# EAGLE schematic Z-ONE (EAGLE 7.2.0)
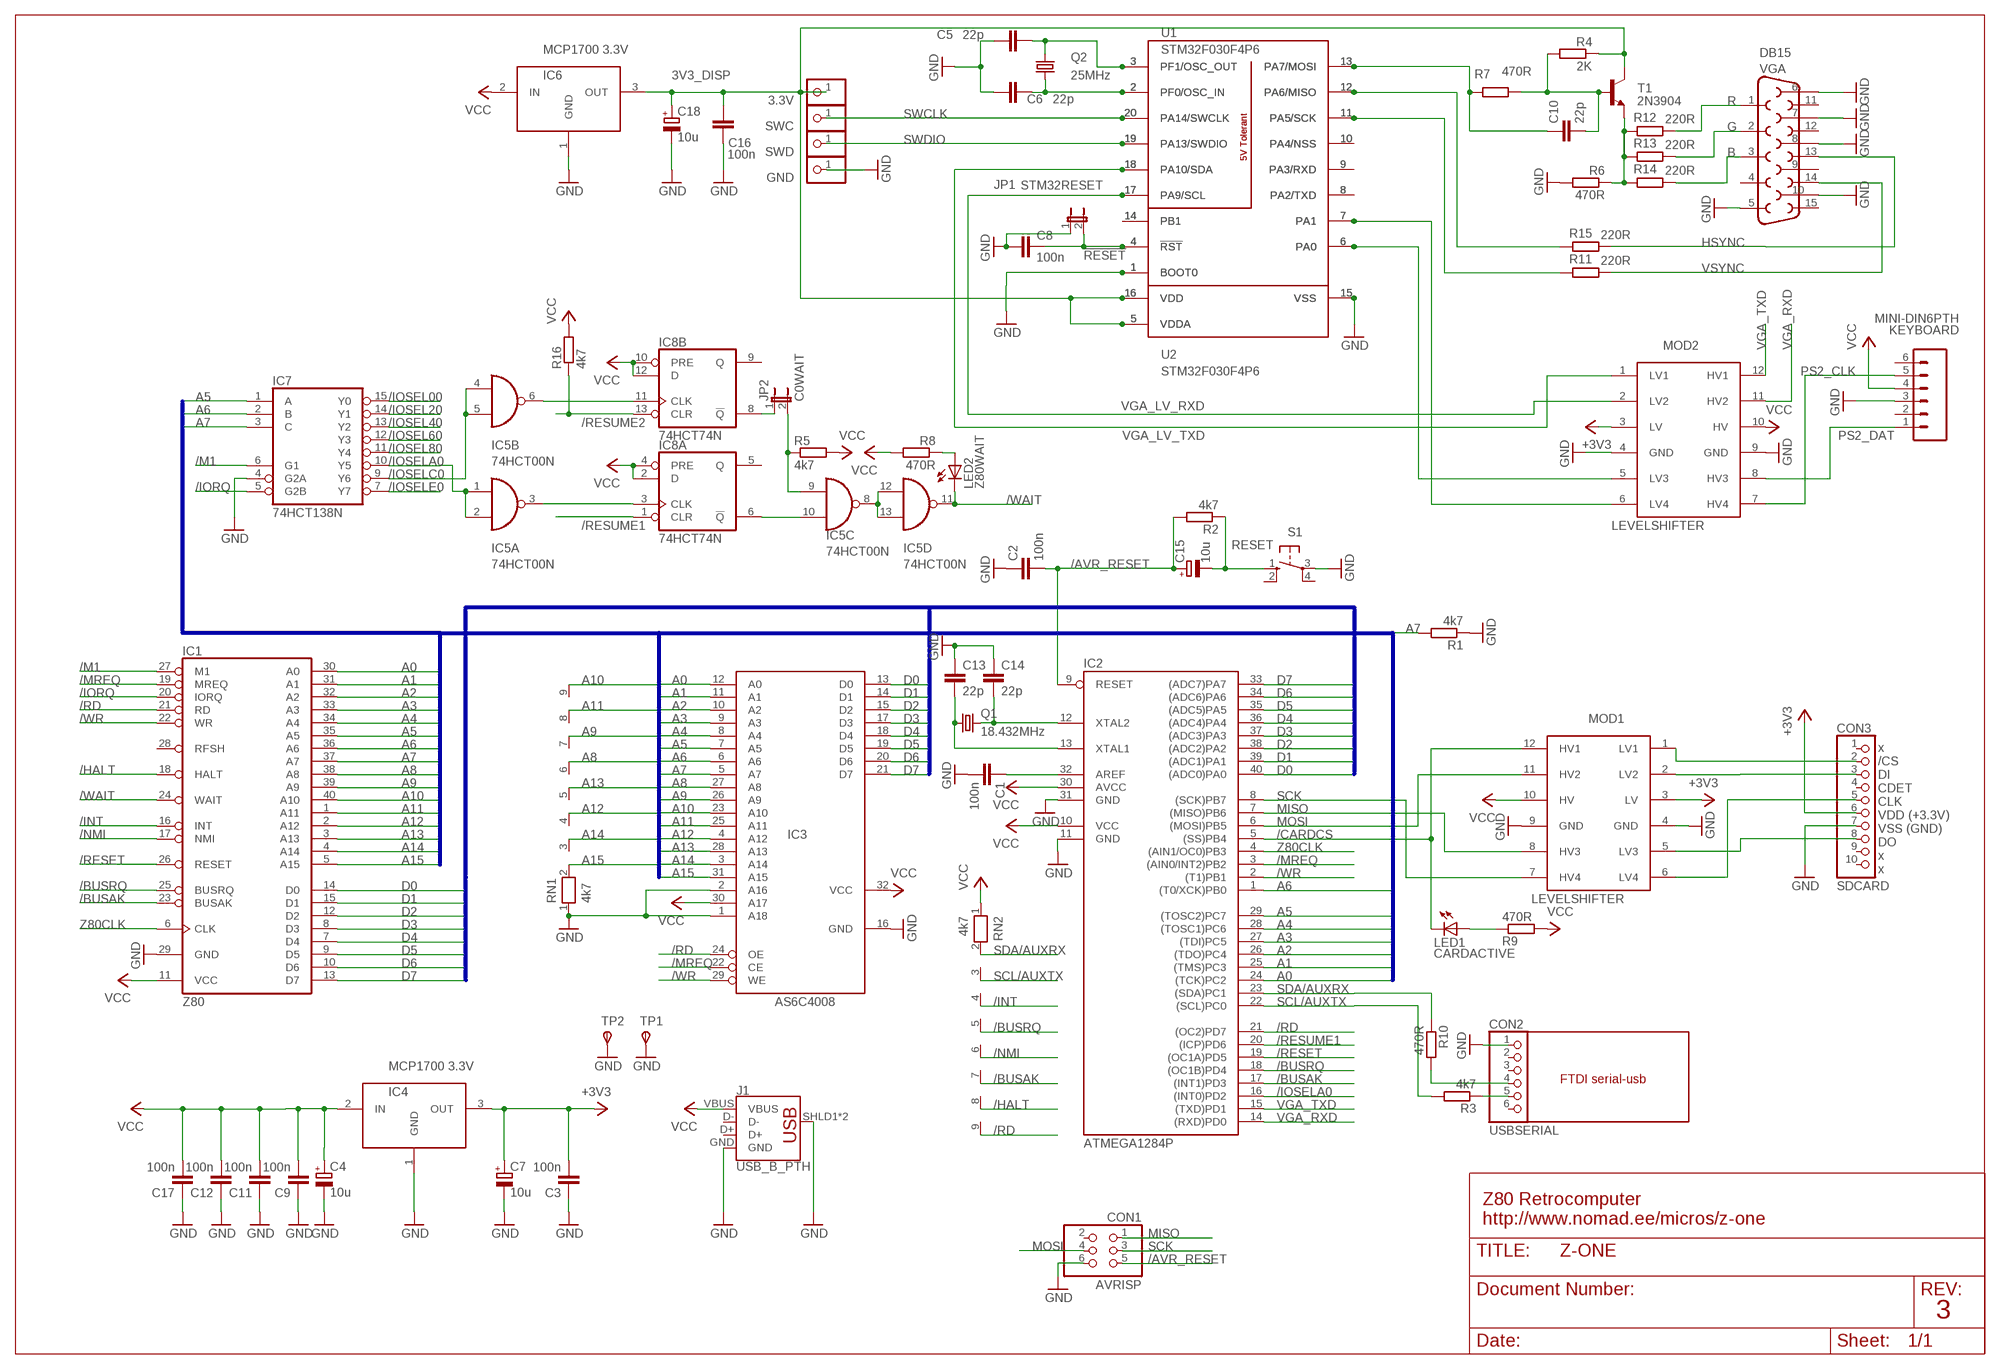
[diagram p0: schematic, sheet 1]

## Parts
3.3V  PINHD-1X1  [1X01]
C1  100n  C-EU025-025X050  [C025-025X050]
C2  100n  C-EU025-025X050  [C025-025X050]
C3  100n  C-EU025-025X050  [C025-025X050]
C4  10u  CPOL-EUE2.5-5  [E2,5-5]
C5  22p  C-EU025-025X050  [C025-025X050]
C6  22p  C-EU025-025X050  [C025-025X050]
C7  10u  CPOL-EUE2.5-5  [E2,5-5]
C8  100n  C-EU025-025X050  [C025-025X050]
C9  100n  C-EU025-025X050  [C025-025X050]
C10  22p  C-EU025-025X050  [C025-025X050]
C11  100n  C-EU025-025X050  [C025-025X050]
C12  100n  C-EU025-025X050  [C025-025X050]
C13  22p  C-EU025-025X050  [C025-025X050]
C14  22p  C-EU025-025X050  [C025-025X050]
C15  10u  CPOL-EUE2.5-5  [E2,5-5]
C16  100n  C-EU025-025X050  [C025-025X050]
C17  100n  C-EU025-025X050  [C025-025X050]
C18  10u  CPOL-EUE2.5-5  [E2,5-5]
CON1  AVRISP  PINHD-2X3  [2X03]
CON2  USBSERIAL  PINHD-1X6  [1X06]
CON3  SDCARD  PINHD-1X10  [1X10]
GND  PINHD-1X1  [1X01]
IC1  Z80  Z80CPU  [DIL40]
IC2  ATMEGA1284P  MEGA32-P  [DIL40]
IC3  AS6C4008  AS6C4008DIP32  [DIP32]
IC4  MCP1700 3.3V  MCP1700TO92  [TO-92]
IC5  74HCT00N  [DIL14]
IC6  MCP1700 3.3V  MCP1700TO92  [TO-92]
IC7  74HCT138N  [DIL16]
IC8  74HCT74N  [DIL14]
J1  USB_B_PTH  [USB-B-PTH]
JP1  STM32RESET  JUMPER-2PTH  [1X02]
JP2  C0WAIT  JUMPER-2PTH  [1X02]
KEYBOARD  MINI-DIN6PTH  [MINI-DIN6]
LED1  CARDACTIVE  LED3MM  [LED3MM]
LED2  Z80WAIT  LED3MM  [LED3MM]
MOD1  LEVELSHIFTER  LEVELSHIFTERNARROW  [LAVELSHIFTER_N]
MOD2  LEVELSHIFTER  LEVELSHIFTERNARROW  [LAVELSHIFTER_N]
Q1  18.432MHz  CRYSTALHC49S  [HC49/S]
Q2  25MHz  CRYSTALHC49S  [HC49/S]
R1  4k7  R-EU_0204/7  [0204/7]
R2  4k7  R-EU_0204/7  [0204/7]
R3  4k7  R-EU_0204/7  [0204/7]
R4  2K  R-EU_0204/7  [0204/7]
R5  4k7  R-EU_0204/7  [0204/7]
R6  470R  R-EU_0204/7  [0204/7]
R7  470R  R-EU_0204/7  [0204/7]
R8  470R  R-EU_0204/7  [0204/7]
R9  470R  R-EU_0204/7  [0204/7]
R10  470R  R-EU_0204/7  [0204/7]
R11  220R  R-EU_0204/7  [0204/7]
R12  220R  R-EU_0204/7  [0204/7]
R13  220R  R-EU_0204/7  [0204/7]
R14  220R  R-EU_0204/7  [0204/7]
R15  220R  R-EU_0204/7  [0204/7]
R16  4k7  R-EU_0204/7  [0204/7]
RN1  4k7  RN08  [RN-9]
RN2  4k7  RN08  [RN-9]
S1  RESET  10-XX  [B3F-10XX]
SWC  PINHD-1X1  [1X01]
SWD  PINHD-1X1  [1X01]
T1  2N3904  [TO92]
TP1  GND  TPSPAD1-13  [P1-13]
TP2  GND  TPSPAD1-13  [P1-13]
U1  STM32F030F4P6  MISC-PROCESSOR_STM32F030F4P6DIL20MODULE  [DIL20WIDE]
U2  STM32F030F4P6  MISC-PROCESSOR_STM32F030F4P6  [MISC-PROCESSOR_TSSOP20]
VGA  DB15  [DB15]

## Nets
3V3_DISP: 3.3V.1 C16.1 C18.+ IC6.3(OUT) R4.1 T1.1(C) U1.5(VDDA) U1.16(VDD) U2.5(VDDA) U2.16(VDD)
25MHZ: C5.2 Q2.2 U1.3(PF1/OSC_OUT) U2.3(PF1/OSC_OUT)
!RESET: C8.1 JP1.2 U1.4(!RST) U2.4(!RST)
+3.3V: C3.2 C7.+ CON3.6 IC4.3(OUT) MOD1.3(LV) MOD2.3(LV) ; supply symbol labelled +3V3
/AVR_RESET: C2.2 C15.+ CON1.5 IC2.9(RESET) R2.2
/BUSAK: IC1.23(BUSAK) IC2.17((INT1)PD3) RN2.7
/BUSRQ: IC1.25(BUSRQ) IC2.18((OC1B)PD4) RN2.5
/CARDCS: IC2.5((SS)PB4) LED1.K(C) MOD1.12(HV1)
/HALT: IC1.18(HALT) RN2.8
/INT: IC1.16(INT) RN2.4
/IORQ: IC1.20(IORQ) IC7.5(G2B)
/IOSEL00: IC7.15(Y0)
/IOSEL20: IC7.14(Y1)
/IOSEL40: IC7.13(Y2)
/IOSEL60: IC7.12(Y3)
/IOSEL80: IC7.11(Y4)
/IOSELA0: IC2.16((INT0)PD2) IC5.1(A:I0) IC5.2(A:I1) IC7.10(Y5)
/IOSELC0: IC5.4(B:I0) IC5.5(B:I1) IC7.9(Y6)
/IOSELE0: IC7.7(Y7)
/M1: IC1.27(M1) IC7.6(G1)
/MREQ: IC1.19(MREQ) IC2.3((AIN0/INT2)PB2) IC3.22(CE)
/NMI: IC1.17(NMI) RN2.6
/RD: IC1.21(RD) IC2.21((OC2)PD7) IC3.24(OE) RN2.9
/RESET: IC1.26(RESET) IC2.19((OC1A)PD5)
/RESUME1: IC2.20((ICP)PD6) IC8.1(A:CLR)
/RESUME2: IC8.13(B:CLR) R16.1
/WAIT: IC1.24(WAIT) IC5.11(D:O) LED2.K(C)
/WR: IC1.22(WR) IC2.2((T1)PB1) IC3.29(WE)
A0: IC1.30(A0) IC2.24((TCK)PC2) IC3.12(A0)
A1: IC1.31(A1) IC2.25((TMS)PC3) IC3.11(A1)
A2: IC1.32(A2) IC2.26((TDO)PC4) IC3.10(A2)
A3: IC1.33(A3) IC2.27((TDI)PC5) IC3.9(A3)
A4: IC1.34(A4) IC2.28((TOSC1)PC6) IC3.8(A4)
A5: IC1.35(A5) IC2.29((TOSC2)PC7) IC3.7(A5) IC7.1(A)
A6: IC1.36(A6) IC2.1((T0/XCK)PB0) IC3.6(A6) IC7.2(B)
A7: IC1.37(A7) IC3.5(A7) IC7.3(C) R1.2
A8: IC1.38(A8) IC3.27(A8) RN1.6
A9: IC1.39(A9) IC3.26(A9) RN1.7
A10: IC1.40(A10) IC3.23(A10) RN1.9
A11: IC1.1(A11) IC3.25(A11) RN1.8
A12: IC1.2(A12) IC3.4(A12) RN1.4
A13: IC1.3(A13) IC3.28(A13) RN1.5
A14: IC1.4(A14) IC3.3(A14) RN1.3
A15: IC1.5(A15) IC3.31(A15) RN1.2
B: R14.1 VGA.3
D0: IC1.14(D0) IC2.40((ADC0)PA0) IC3.13(D0)
D1: IC1.15(D1) IC2.39((ADC1)PA1) IC3.14(D1)
D2: IC1.12(D2) IC2.38((ADC2)PA2) IC3.15(D2)
D3: IC1.8(D3) IC2.37((ADC3)PA3) IC3.17(D3)
D4: IC1.7(D4) IC2.36((ADC4)PA4) IC3.18(D4)
D5: IC1.9(D5) IC2.35((ADC5)PA5) IC3.19(D5)
D6: IC1.10(D6) IC2.34((ADC6)PA6) IC3.20(D6)
D7: IC1.13(D7) IC2.33((ADC7)PA7) IC3.21(D7)
G: R13.1 VGA.2
GND: C1.2 C2.1 C3.1 C4.- C5.1 C6.1 C7.- C8.2 C9.1 C11.1 C12.1 C13.1 C14.1 C16.2 C17.1 C18.- CON1.6 CON2.1 CON3.7 GND.1 IC1.29(GND) IC2.11(GND) IC2.31(GND) IC3.1(A18) IC3.2(A16) IC3.16(GND) IC4.1(GND) IC6.1(GND) IC7.4(G2A) J1.GND J1.SHLD1(SHIELD) J1.SHLD2(SHIELD) JP1.1 KEYBOARD.3 MOD1.4(GND) MOD1.9(GND) MOD2.4(GND) MOD2.9(GND) R1.1 R6.2 RN1.1 S1.3(P) TP1.TP(PP) TP2.TP(PP) U1.1(BOOT0) U1.15(VSS) U2.1(BOOT0) U2.15(VSS) VGA.5 VGA.6 VGA.7 VGA.8 VGA.10
HSYNC: R15.1 VGA.13
MISO: CON1.1 IC2.7((MISO)PB6) MOD1.8(HV3)
MOSI: CON1.4 IC2.6((MOSI)PB5) MOD1.11(HV2)
N$1: C6.2 Q2.1 U1.2(PF0/OSC_IN) U2.2(PF0/OSC_IN)
N$2: R15.2 U1.12(PA6/MISO) U2.12(PA6/MISO)
N$3: IC5.3(A:O) IC8.3(A:CLK)
N$4: R6.1 R12.2 R13.2 R14.2 T1.3(E)
N$5: C14.2 IC2.12(XTAL2) Q1.2
N$6: C1.1 IC2.32(AREF)
N$8: R11.2 U1.11(PA5/SCK) U2.11(PA5/SCK)
N$9: MOD2.6(LV4) U1.7(PA1) U2.7(PA1)
N$10: MOD2.5(LV3) U1.6(PA0) U2.6(PA0)
N$11: C10.2 R4.2 R7.1 T1.2(B)
N$12: C10.1 R7.2 U1.13(PA7/MOSI) U2.13(PA7/MOSI)
N$14: U1.8(PA2/TXD) U2.8(PA2/TXD)
N$15: CON2.5 R3.1
N$16: CON3.3 MOD1.2(LV2)
N$17: IC5.9(C:I0) JP2.2 R5.1
N$18: CON3.8 MOD1.5(LV3)
N$19: CON3.5 MOD1.6(LV4)
N$20: IC5.6(B:O) IC8.11(B:CLK)
N$21: C13.2 IC2.13(XTAL1) Q1.1
N$22: U1.9(PA3/RXD) U2.9(PA3/RXD)
N$24: IC8.8(B:!Q) JP2.1
N$103: U1.10(PA4/NSS) U2.10(PA4/NSS)
N$104: CON2.4 R10.2
N$448: U1.14(PB1) U2.14(PB1)
N$532: IC5.10(C:I1) IC8.6(A:!Q)
N$533: C15.- R2.1 S1.1(S)
N$534: CON3.2 MOD1.1(LV1)
N$536: IC5.8(C:O) IC5.12(D:I0) IC5.13(D:I1)
N$692: LED2.A R8.1
N$693: LED1.A R9.1
PS2_CLK: KEYBOARD.5 MOD2.7(HV4)
PS2_DAT: KEYBOARD.1 MOD2.8(HV3)
R: R12.1 VGA.1
SCK: CON1.3 IC2.8((SCK)PB7) MOD1.7(HV4)
SCL/AUXTX: IC2.22((SCL)PC0) R3.2 RN2.3
SDA/AUXRX: IC2.23((SDA)PC1) R10.1 RN2.2
SWCLK: SWC.1 U1.20(PA14/SWCLK) U2.20(PA14/SWCLK)
SWDIO: SWD.1 U1.19(PA13/SWDIO) U2.19(PA13/SWDIO)
VCC: C4.+ C9.2 C11.2 C12.2 C17.2 IC1.11(VCC) IC2.10(VCC) IC2.30(AVCC) IC3.30(A17) IC3.32(VCC) IC4.2(IN) IC6.2(IN) IC8.2(A:D) IC8.4(A:PRE) IC8.10(B:PRE) IC8.12(B:D) J1.VBUS KEYBOARD.4 MOD1.10(HV) MOD2.10(HV) R5.2 R8.2 R9.2 R16.2 RN2.1
VGA_LV_RXD: MOD2.2(LV2) U1.17(PA9/SCL) U2.17(PA9/SCL)
VGA_LV_TXD: MOD2.1(LV1) U1.18(PA10/SDA) U2.18(PA10/SDA)
VGA_RXD: IC2.14((RXD)PD0) MOD2.11(HV2)
VGA_TXD: IC2.15((TXD)PD1) MOD2.12(HV1)
VSYNC: R11.1 VGA.14
Z80CLK: IC1.6(CLK) IC2.4((AIN1/OC0)PB3)
Unconnected: CON1.2 CON2.2 CON2.3 CON2.6 CON3.1 CON3.4 CON3.9 CON3.10 IC1.28(RFSH) IC8.5(A:Q) IC8.9(B:Q) J1.D+ J1.D- KEYBOARD.2 KEYBOARD.6 S1.2(S1) S1.4(P1) VGA.4 VGA.9 VGA.11 VGA.12 VGA.15

## Buses
A[0..15]
D[0..7]

## Notes on the sheet
- x
  /CS
  DI
  CDET
  CLK
  VDD (+3.3V)
  VSS (GND)
  DO
  x
  x
- FTDI serial-usb
- Z80 Retrocomputer
  http://www.nomad.ee/micros/z-one
- 3

## Power pins joined to a net without a drawn wire
GND: IC5.7(P:GND) IC7.8(GND) IC8.7(P:GND)
VCC: IC5.14(P:VCC) IC7.16(VCC) IC8.14(P:VCC)

## Library data of the parts
3.3V GND SWC SWD = pinhead:PINHD-1X1: PIN HEADER
C1-C3 C8 C9 C11-C14 C16 C17 = rcl:C-EU: CAPACITOR, European symbol; PARTNO: 0.1UF, 0603
C4 C7 C15 C18 = rcl:CPOL-EU: POLARIZED CAPACITOR, European symbol
C5 C6 C10 = rcl:C-EU: CAPACITOR, European symbol; PARTNO: 22PF, 0603
CON1 = pinhead:PINHD-2X3: PIN HEADER
CON2 = pinhead:PINHD-1X6: PIN HEADER
CON3 = pinhead:PINHD-1X10: PIN HEADER
IC1 = zilog:Z80CPU: Z80 FAMILY DEVICE
IC2 = atmel:MEGA32-P: MICROCONTROLLER 32 Kbytes FLASH 2 Kbytes SRAM 1 Kbytes EEPROM USART 8-channel 10 bit ADC Source: www.atmel.com .. doc2503.pdf; MPN: ATMEGA32-16PU; OC_FARNELL: 1661729; OC_NEWARK: 51P1794
IC3 = mast:AS6C4008
IC4 IC6 = mast:MCP1700
IC5 = 74xx-eu:74*00: Quad 2-input NAND gate
IC7 = 74xx-eu:74*138: 3-line to 8-line DECODER/DEMULTIPLEXER
IC8 = 74xx-eu:74*74: Dual D type positive edge triggered FLIP FLOP, preset and clear
J1 = SparkFun-Connectors:USB_B: USB Type B Connector SparkFun Products: SparkFun Stepoko <https://www.sparkfun.com/products/13899> PTH; PROD_ID: CONN-08278; SF_ID: PRT-00139
JP1 JP2 = SparkFun-Retired:JUMPER-2: Jumper Basic 0.1" spaced jumper. Use with breakaway headers.
KEYBOARD = SparkFun-Retired:MINI-DIN6: Mini DIN 6 Connector SparkFun used to sell this connector and has used it on a couple designs, however the connector and the designs are now retired. Mini DIN 6 Connector [RETIRED] <https://www.sparkfun.com/products/retired/8509> SparkFun Key Counter - PS2 [RETIRED] <https://www.sparkfun.com/products/retired/8652> Commonly found on the back of a computer for PS2 keyboard and mice. Schematic and footprint are proven.
LED1 LED2 = led:LED: LED OSRAM: - CHIPLED LG R971, LG N971, LY N971, LG Q971, LY Q971, LO R971, LY R971 LH N974, LH R974 LS Q976, LO Q976, LY Q976 LO Q996 - Hyper CHIPLED LW Q18S LB Q993, LB Q99A, LB R99A - SideLED LS A670, LO A670, LY A670, LG A670, LP A670 LB A673, LV A673, LT A673, LW A673 LH A674 LY A675 LS A676, LA A676, LO A676, LY A676, LW A676 LS A679, LY A679, LG A679 - Hyper Micro SIDELED® LS Y876, LA Y876, LO Y876, LY Y876 LT Y87S - SmartLED LW L88C, LW L88S LB L89C, LB L89S, LG L890 LS L89K, LO L89K, LY L89K LS L896, LA L896, LO L896, LY L896 - TOPLED LS T670, LO T670, LY T670, LG T670, LP T670 LSG T670, LSP T670, LSY T670, LOP T670, LYG T670 LG T671, LOG T671, LSG T671 LB T673, LV T673, LT T673, LW T673 LH T674 LS T676, LA T676, LO T676, LY T676, LB T676, LH T676, LSB T676, LW T676 LB T67C, LV T67C, LT T67C, LS T67K, LO T67K, LY T67K, LW E67C LS E67B, LA E67B, LO E67B, LY E67B, LB E67C, LV E67C, LT E67C LW T67C LS T679, LY T679, LG T679 LS T770, LO T770, LY T770, LG T770, LP T770 LB T773, LV T773, LT T773, LW T773 LH T774 LS E675, LA E675, LY E675, LS T675 LS T776, LA T776, LO T776, LY T776, LB T776 LHGB T686 LT T68C, LB T68C - Hyper Mini TOPLED® LB M676 - Mini TOPLED Santana® LG M470 LS M47K, LO M47K, LY M47K Source: http://www.osram.convergy.de LUXEON: - LUMILED® LXK2-PW12-R00, LXK2-PW12-S00, LXK2-PW14-U00, LXK2-PW14-V00 LXK2-PM12-R00, LXK2-PM12-S00, LXK2-PM14-U00 LXK2-PE12-Q00, LXK2-PE12-R00, LXK2-PE12-S00, LXK2-PE14-T00, LXK2-PE14-U00 LXK2-PB12-K00, LXK2-PB12-L00, LXK2-PB12-M00, LXK2-PB14-N00, LXK2-PB14-P00, LXK2-PB14-Q00 LXK2-PR12-L00, LXK2-PR12-M00, LXK2-PR14-Q00, LXK2-PR14-R00 LXK2-PD12-Q00, LXK2-PD12-R00, LXK2-PD12-S00 LXK2-PH12-R00, LXK2-PH12-S00 LXK2-PL12-P00, LXK2-PL12-Q00, LXK2-PL12-R00 Source: www.luxeon.com KINGBRIGHT: KA-3528ASYC Source: www.kingbright.com
MOD1 MOD2 = mast:LEVELSHIFTER
Q1 Q2 = crystal:CRYSTAL: CRYSTAL; OC_FARNELL: 1667008; OC_NEWARK: unknown
R1-R3 R5 R10 R16 = rcl:R-EU_: RESISTOR, European symbol
R4 = resistor:R-EU_: RESISTOR, European symbol; PARTNO: 2K, 0603
R6-R9 = resistor:R-EU_: RESISTOR, European symbol; PARTNO: 475R, 0603
R11-R15 = resistor:R-EU_: RESISTOR, European symbol
RN1 RN2 = resistor-net:RN08: RESISTOR NETWORK; OC_FARNELL: unknown; OC_NEWARK: unknown
S1 = switch-omron:10-XX: OMRON SWITCH; MPN: B3F-1000; OC_FARNELL: 176432; OC_NEWARK: 36M3542
T1 = transistor:2N3904: NPN TRANSISTOR
TP1 TP2 = testpad:TPS: TEST PIN
U1 U2 = z80_tiny:MISC-PROCESSOR_STM32F030F4P6
VGA = SparkFun-Retired:DB15: DB15 / VGA right angle through-hole female connector.